# EasyEDA schematic SAIIoT2020_AccelKart.json

## Sheets
1 Kart: TITLE: Accelerometer Kart; REV: 1.0; Date: 2020-12-13; Sheet: 1/1; Company: SAIIoT2020 - ISCTE-IUL
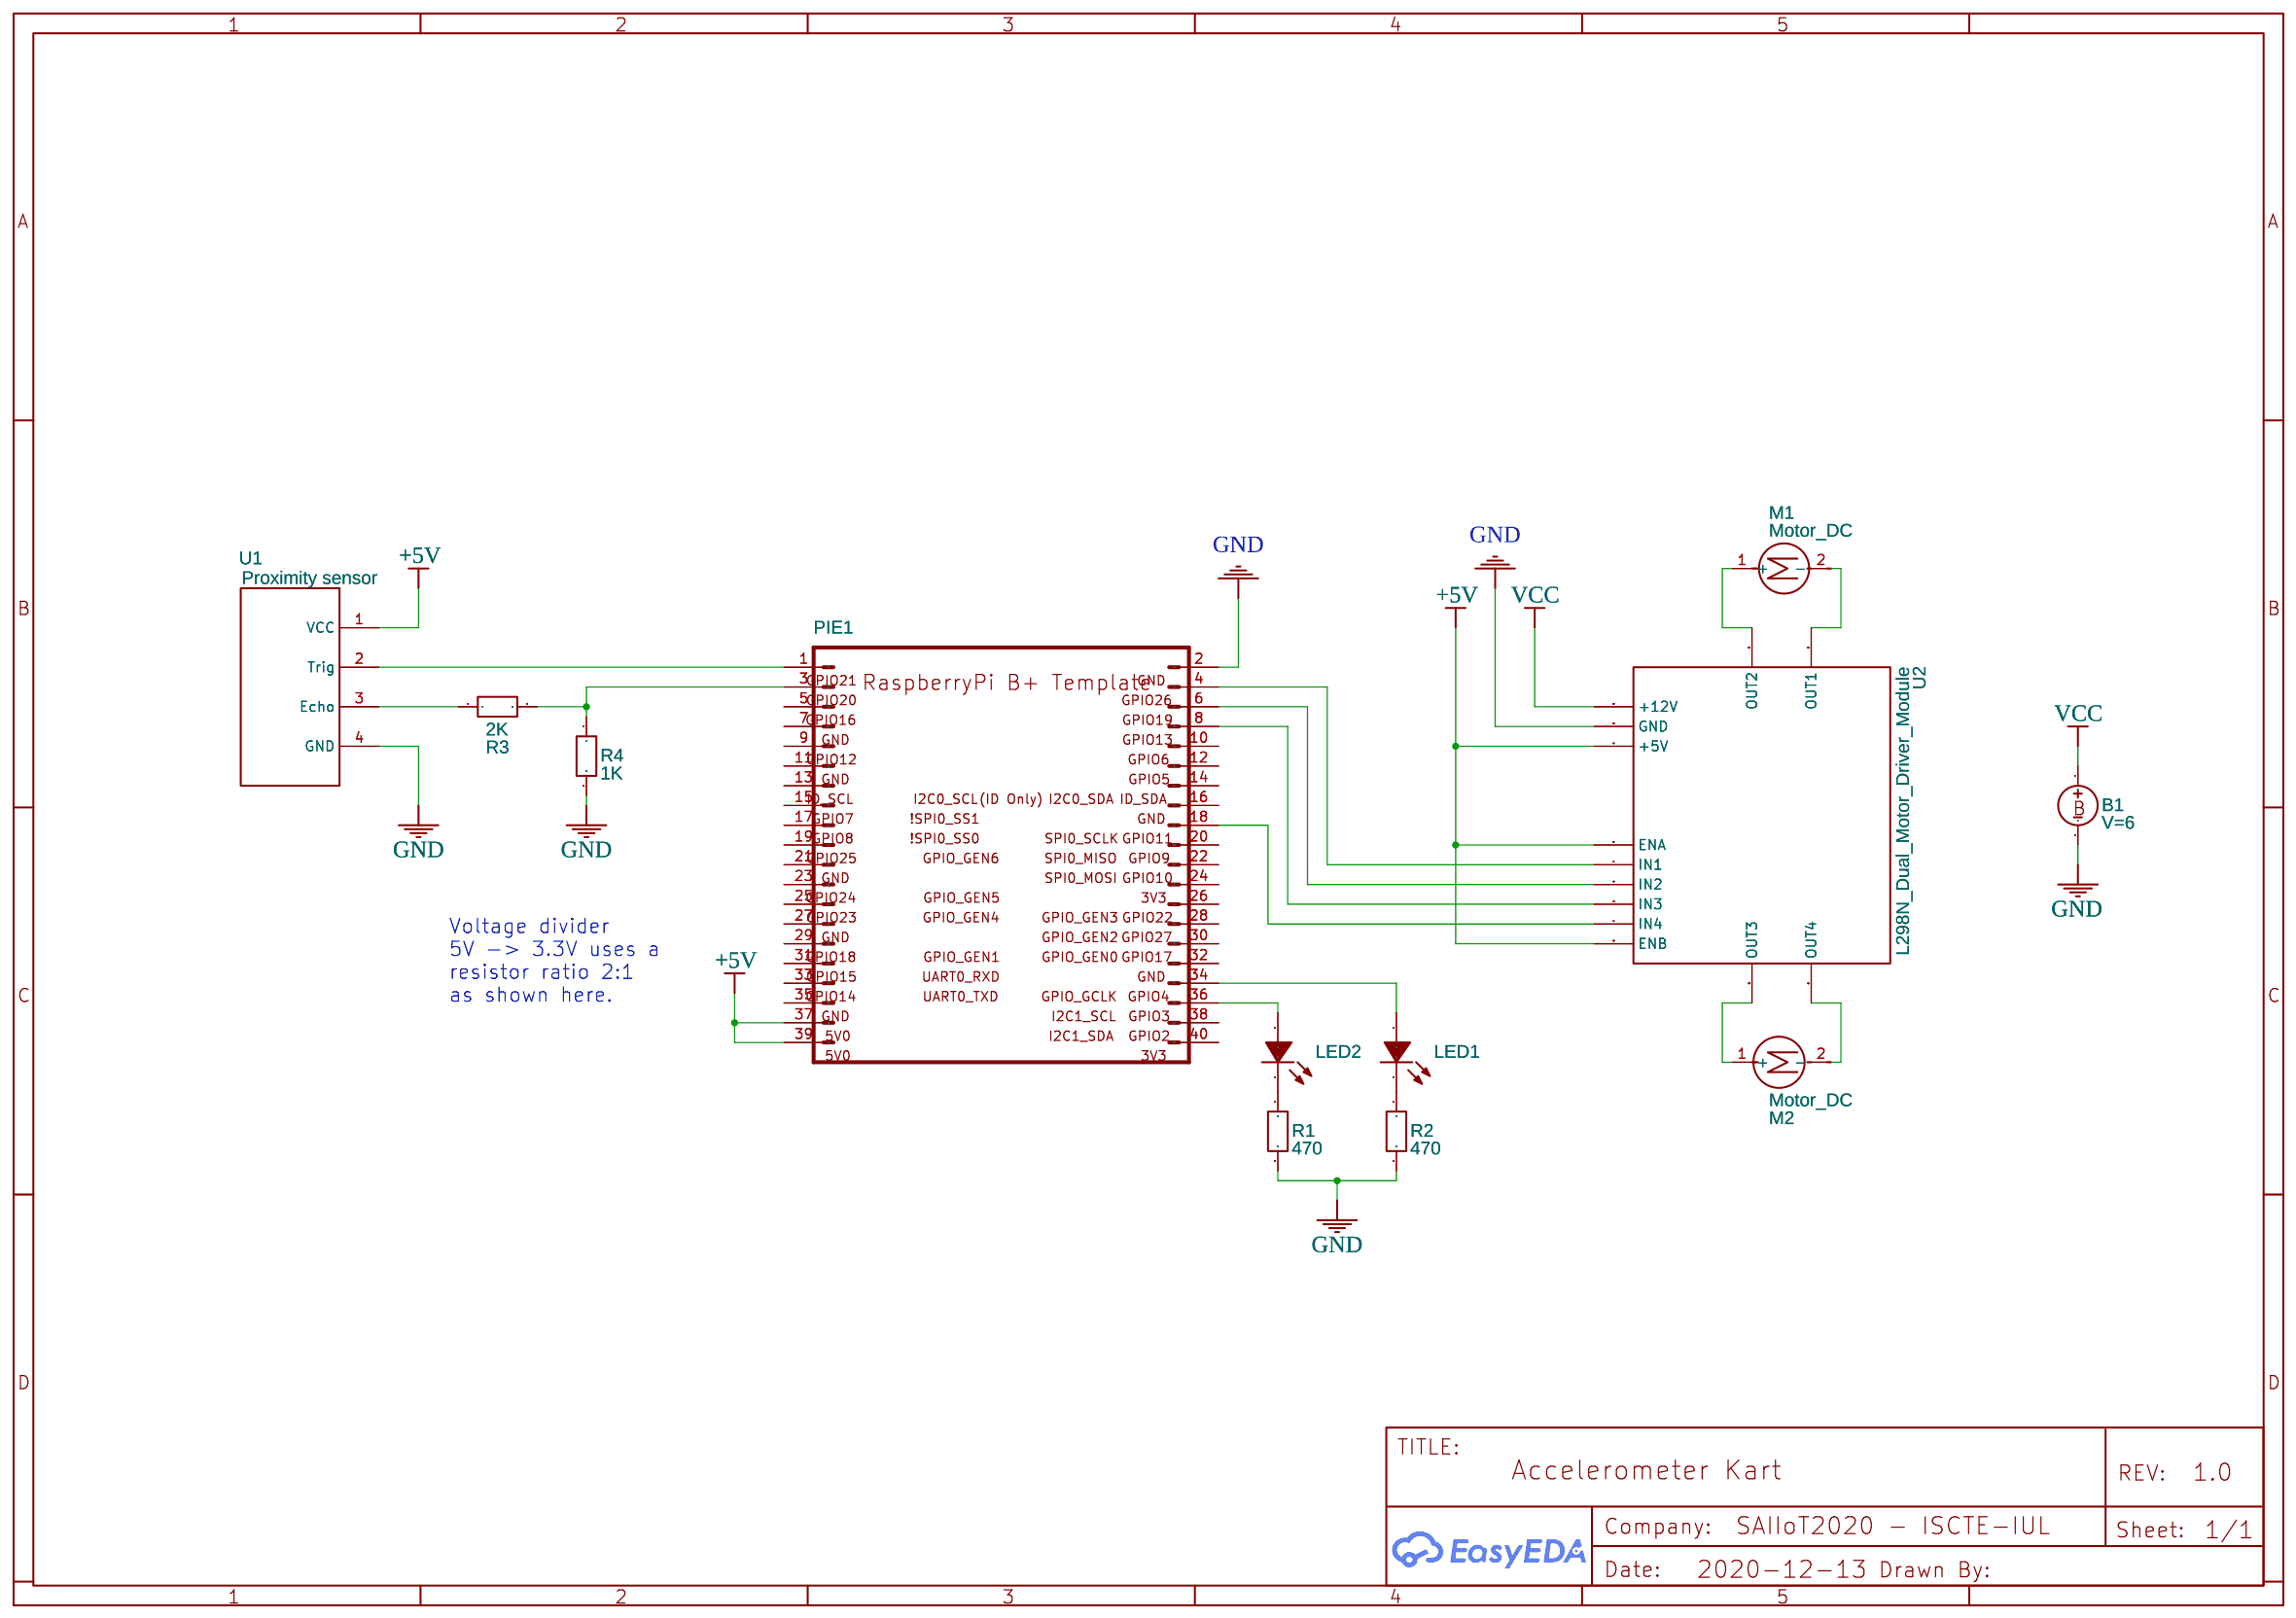
[diagram p0: Kart]
2 Remote 1: TITLE: Accelerometer Kart Remote 1; Date: 2021-01-09; Drawn By: miguel.c.rodrigues
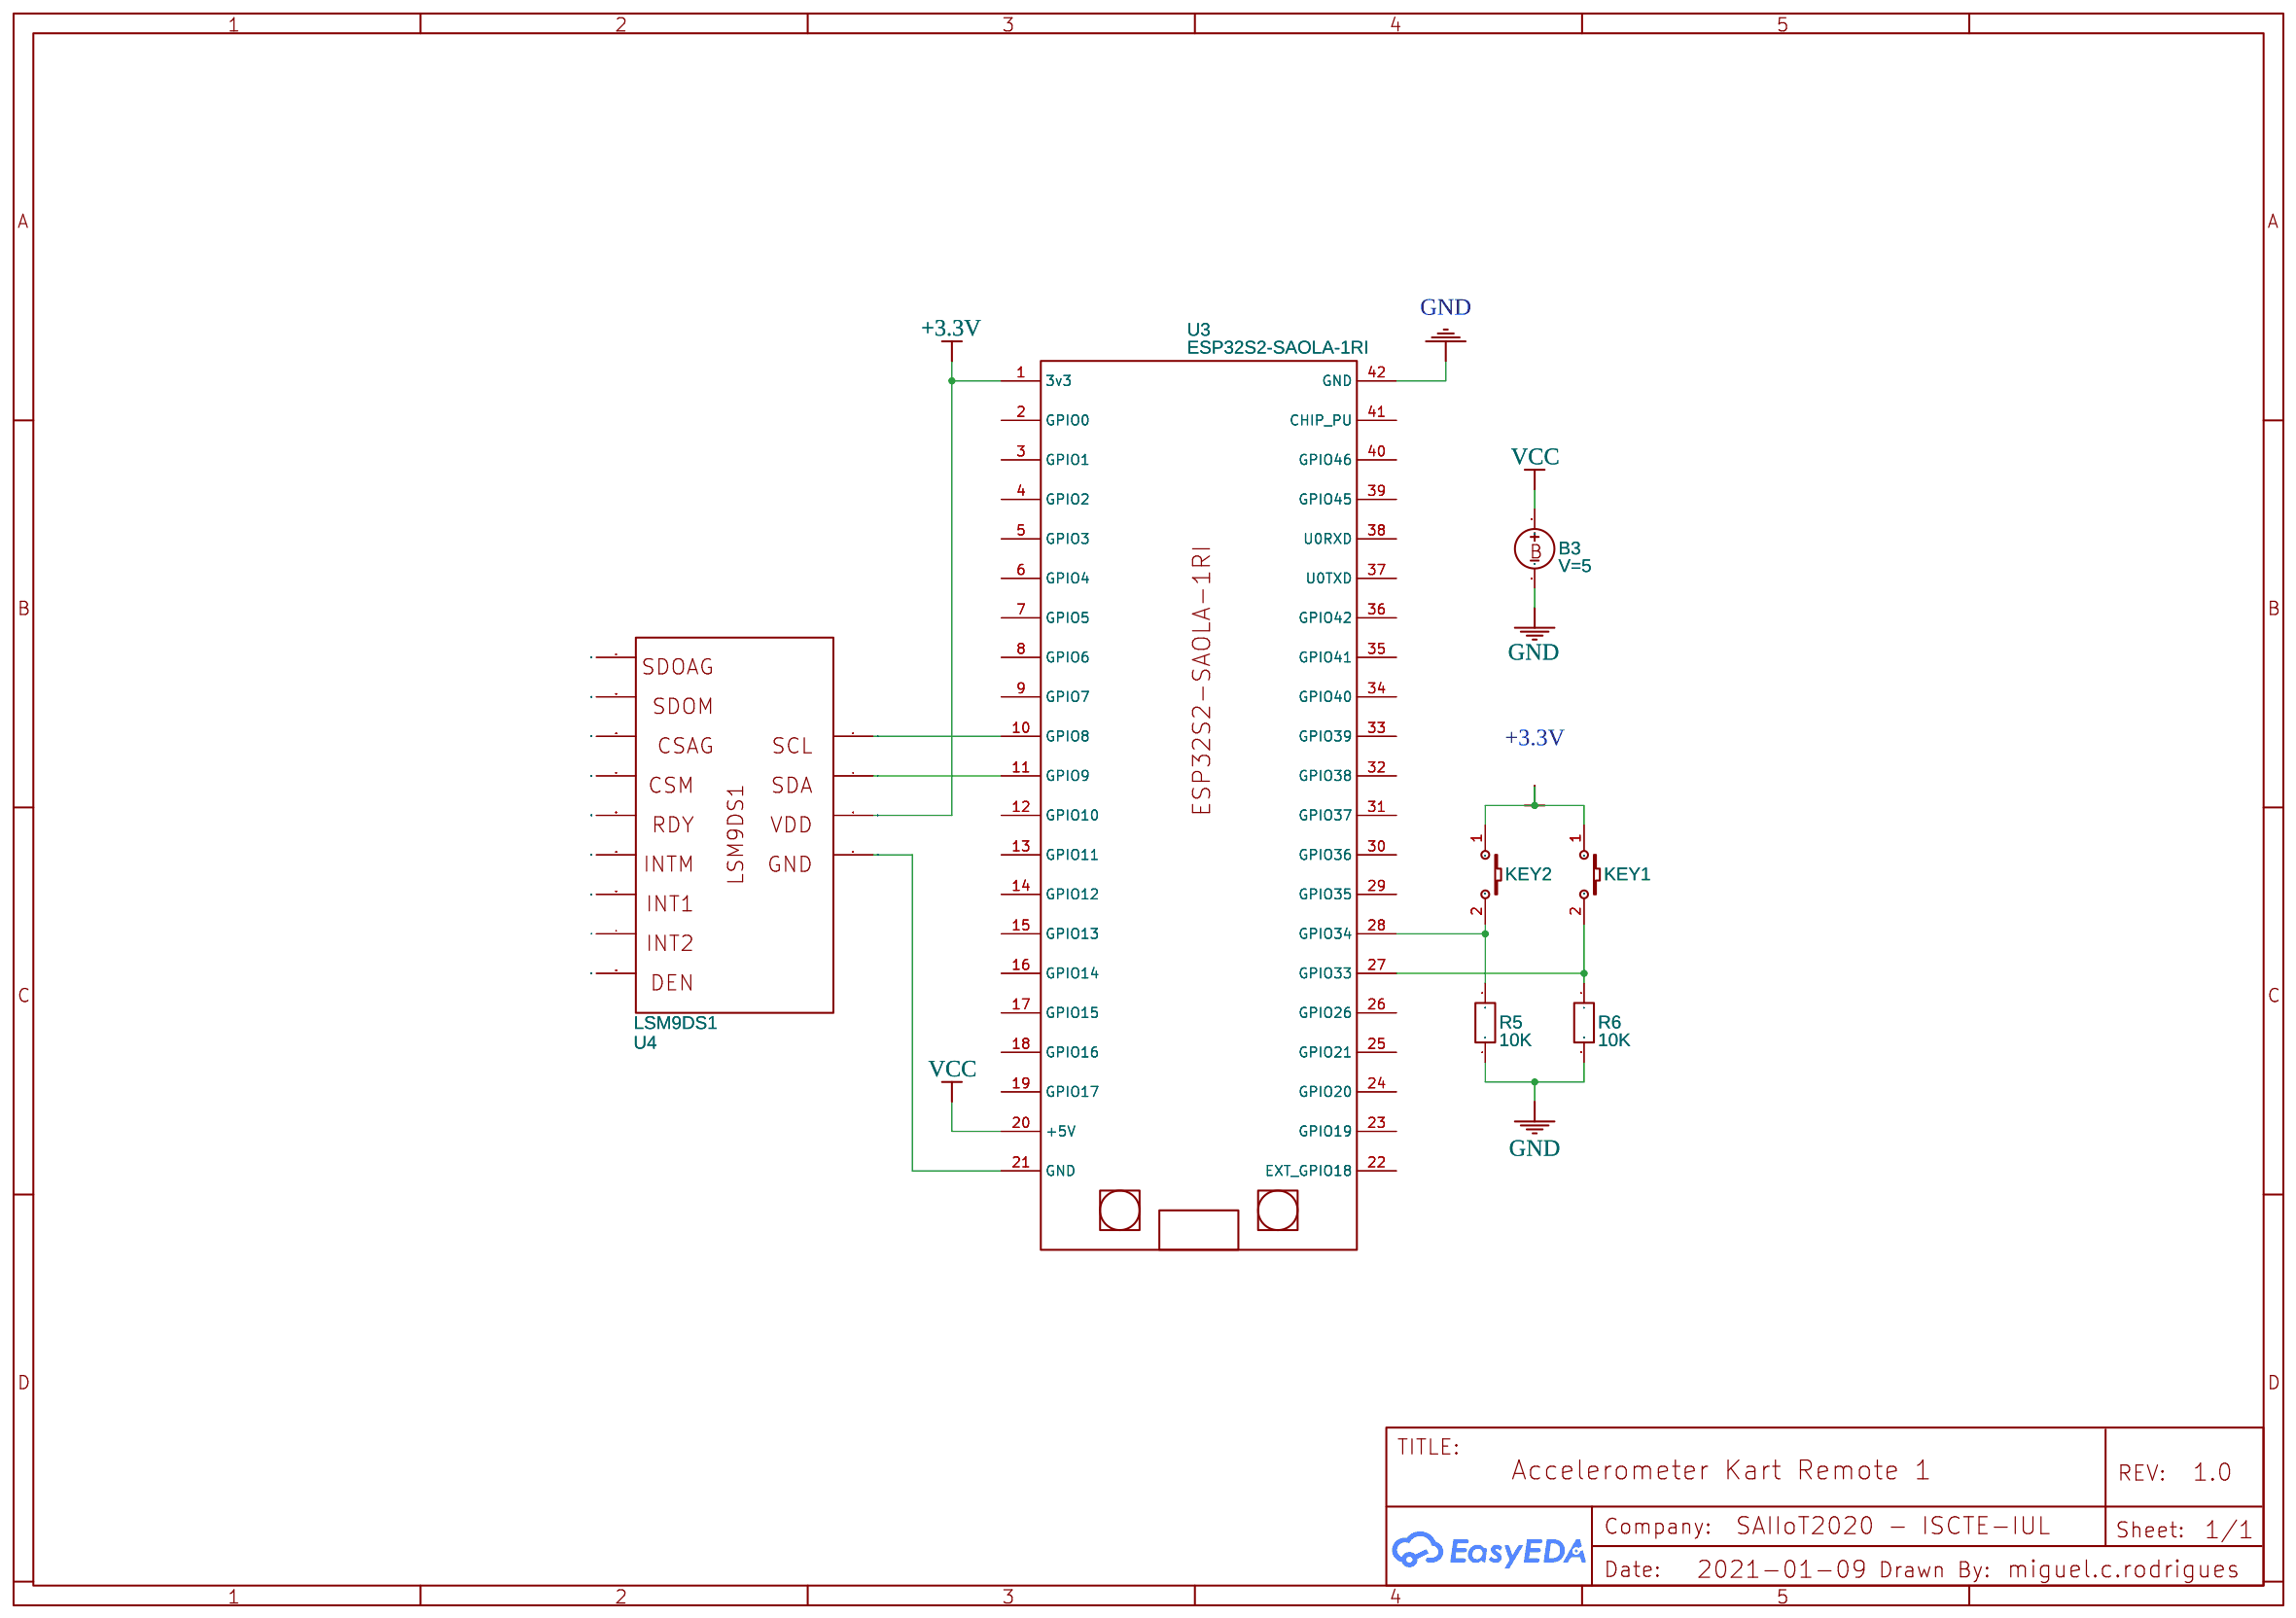
[diagram p1: Remote 1]
3 Remote 2: TITLE: Accelerometer Kart Remote 2; Date: 2021-01-09; Drawn By: miguel.c.rodrigues
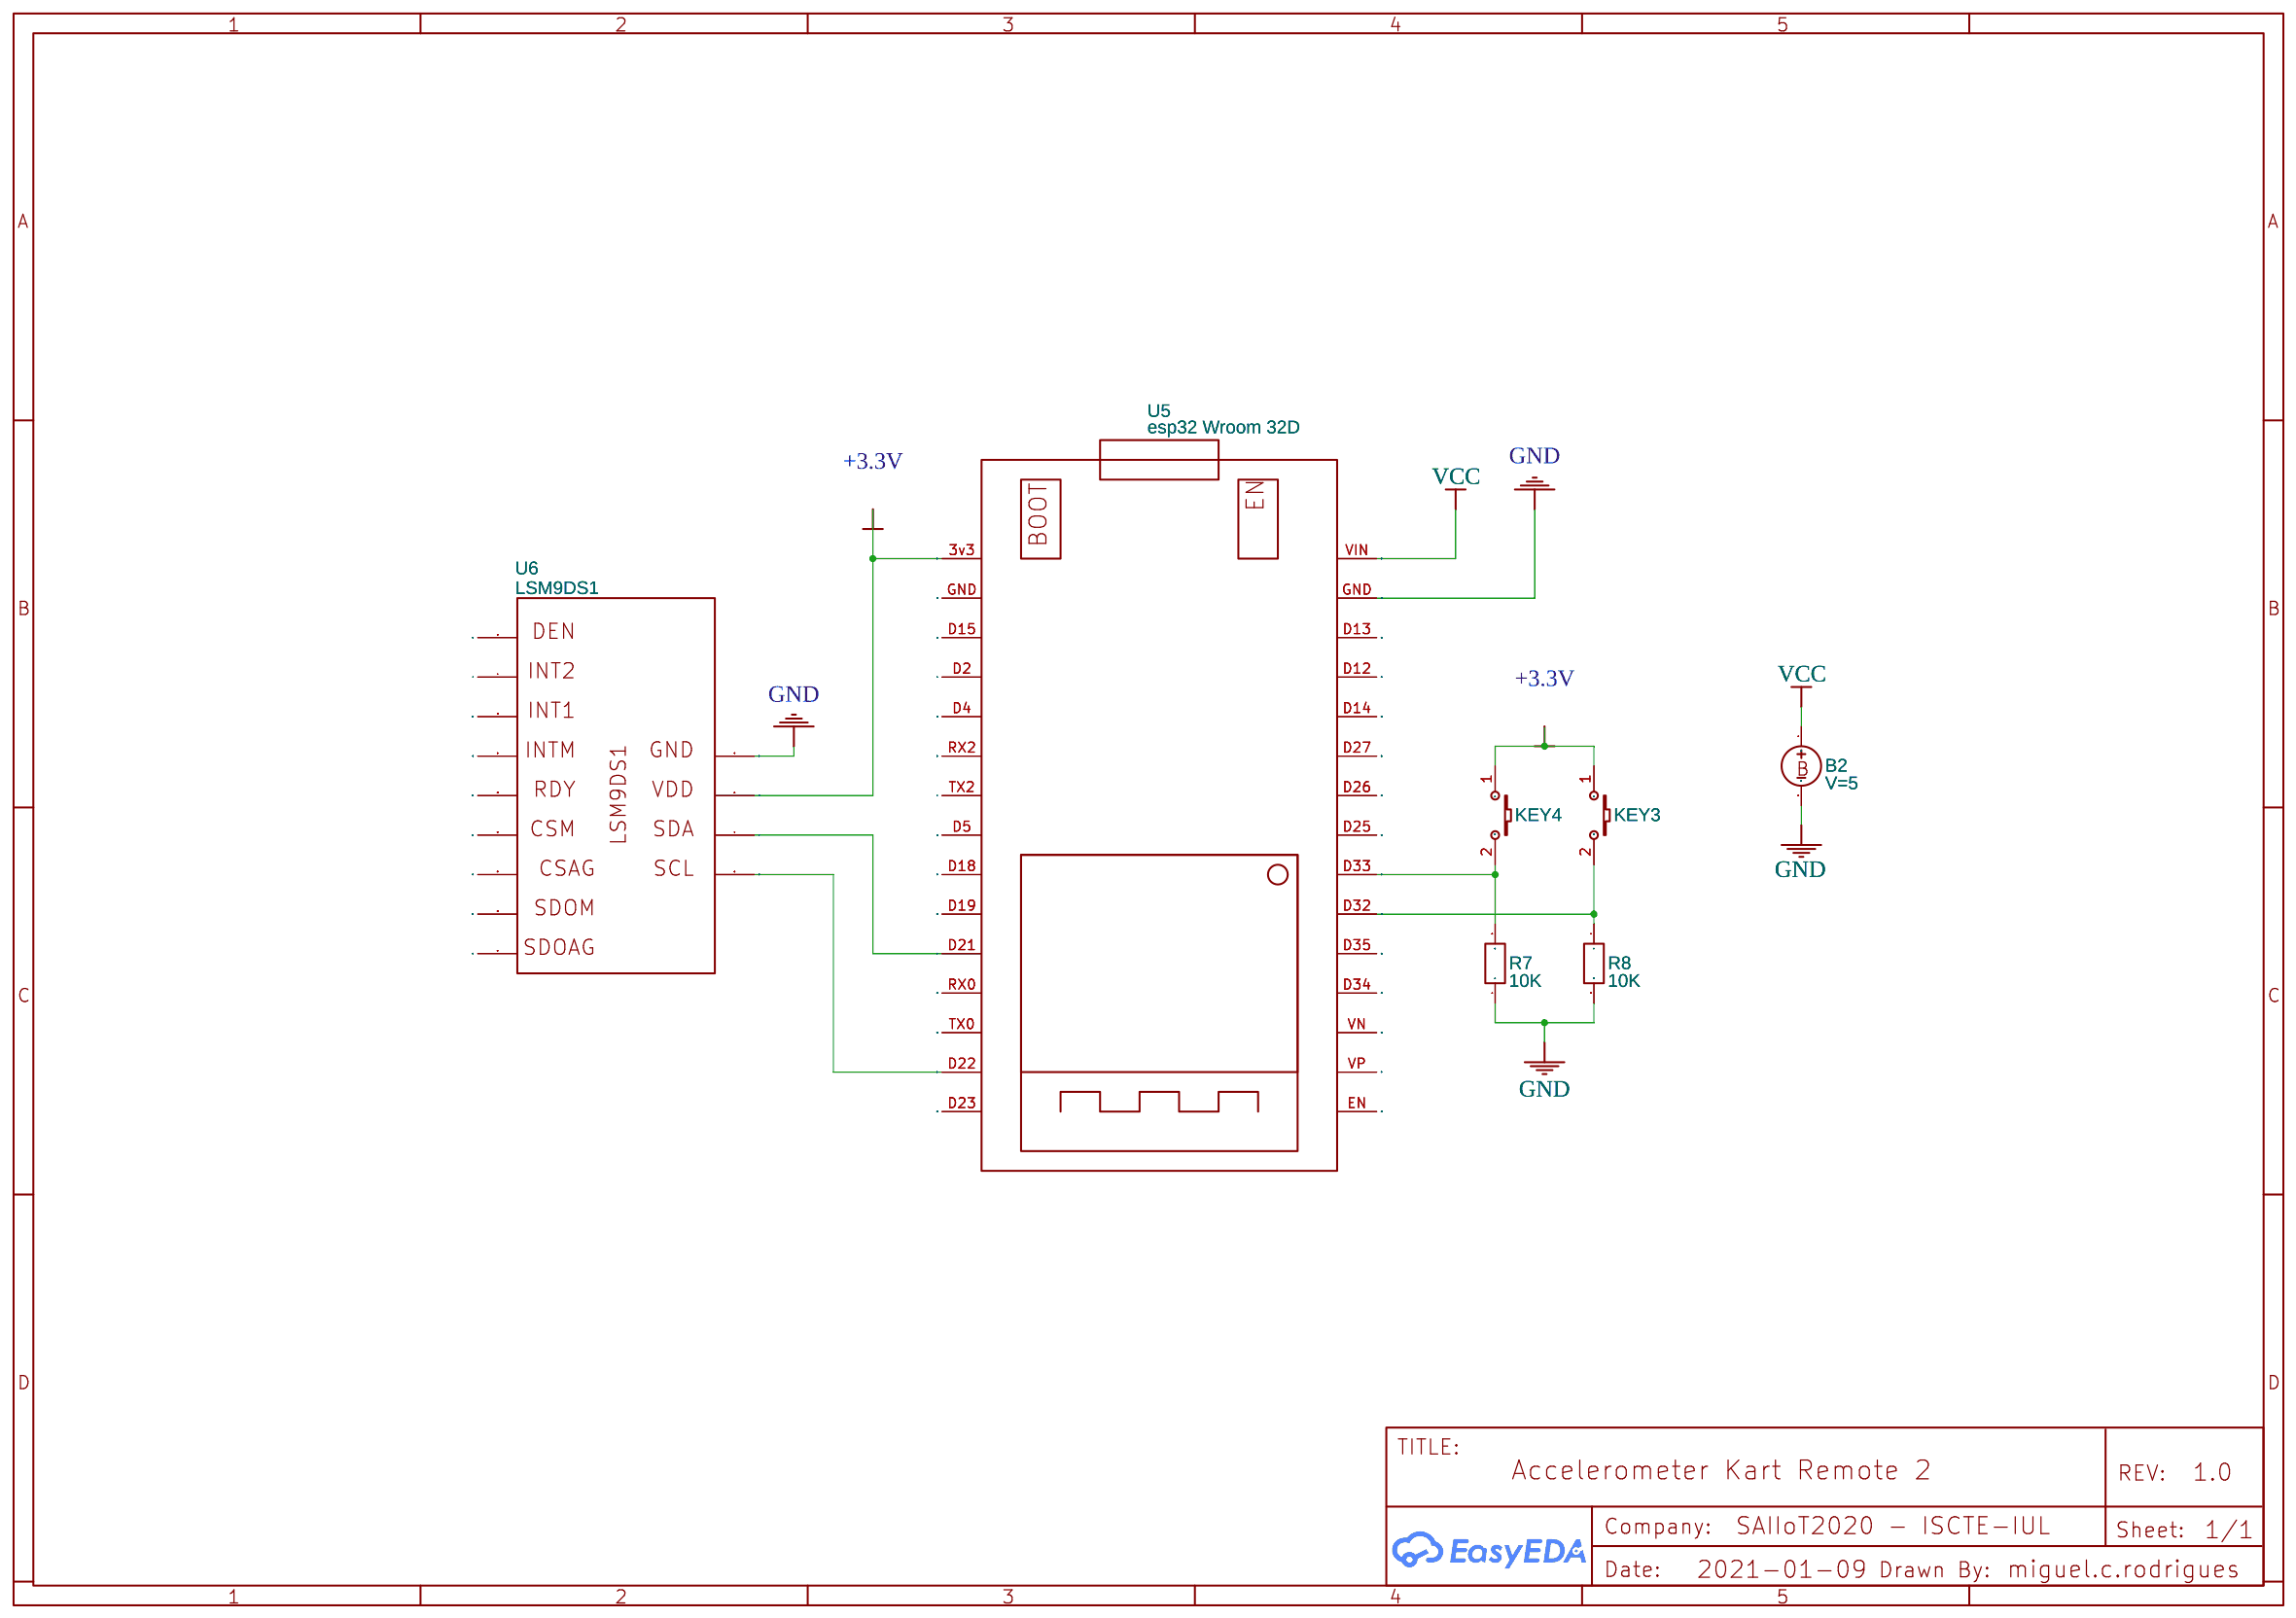
[diagram p2: Remote 2]

## Parts
sheet Kart
B1  V=6  [HDR1X2]
LED1  LED-0603_R  [LED0603_RED]
LED2  LED-0603_R  [LED0603_RED]
M1  Motor_DC  [CONN-TH_2P-P5.08]
M2  Motor_DC  [CONN-TH_2P-P5.08]
PIE1  PA_RASPI_BPLUS_BRD  [PA_RASPI_PLATE_BPLUS]
R1  470  [R0603]
R2  470  [R0603]
R3  2K  [R0603]
R4  1K  [R0603]
U1  Proximity sensor  [HC-SR04]
U2  L298N_Dual_Motor_Driver_Module  [L298N DUAL H-BRIDGE MOTOR DRIVER MODULE FOOTPRINT]
sheet Remote 1
B3  V=5  [HDR1X2]
KEY1  K2-3.6×6.1_SMD  [KEY-SMD_2P-L6.2-W3.6-LS8.0]
KEY2  K2-3.6×6.1_SMD  [KEY-SMD_2P-L6.2-W3.6-LS8.0]
R5  10K  [R0603]
R6  10K  [R0603]
U3  ESP32S2-SAOLA-1RI  [ESP32S2-SAOLA-1RI]
U4  LSM9DS1
sheet Remote 2
B2  V=5  [HDR1X2]
KEY3  K2-3.6×6.1_SMD  [KEY-SMD_2P-L6.2-W3.6-LS8.0]
KEY4  K2-3.6×6.1_SMD  [KEY-SMD_2P-L6.2-W3.6-LS8.0]
R7  10K  [R0603]
R8  10K  [R0603]
U5  esp32 Wroom 32D
U6  LSM9DS1

## Library data of the parts
B1-B3 = BV_Behavioral_Source: Link: http://ltwiki.org/LTspiceHelpXVII/LTspiceHelp/html/B-device.htm; Contributor: EasyEDA; sim: true
LED1 LED2 = LED-0603_R: Manufacturer: EVERLIGHT(台湾亿光); Manufacturer Part: 19-217/R6C-AL1M2VY/3T; Supplier Part: C72044; Supplier: LCSC; Contributor: LCEDA_01
M1 M2 = Motor_DC: Contributor: KiCAD; license: https://www.gnu.org/licenses/lgpl-2.1.html
PIE1 = PA_RASPI_BPLUS_BRD: PatternAgents Raspberry Pi B+ Template; Contributor: PatternAgents
R1-R8 = R_0603_EU: Contributor: LCEDA_Lib
U1 = Proximity sensor: Contributor: manorius
U2 = L298N_Dual_Motor_Driver_Module: catid: 20; Contributor: sauron1024; Mounted: No; sim: true
KEY1-KEY4 = K2-3.6×6.1_SMD: Supplier Part: C118141; Supplier: LCSC; Manufacturer Part: K2-1107ST-A4SW-06; Contributor: LCEDA_Lib; 制造商: 韩国韩荣
U3 = ESP32S2-SAOLA-1RI: Manufacturer Part: ESP32 DEV KIT; Contributor: leoScript; link: https://www.espressif.com/en/products/hardware/esp32-devkitc/overview
U4 U6 = LSM9DS1: catid: 20; Contributor: jeniffer.gigi; Manufacturer: Sparkfun; sim: true
U5 = esp32 Wroom 32D: link: https://www.electronicscomp.com/esp32-development-board-with-wifi-bluetooth-india?gclid=Cj0KCQiA0ZHwBRCRARIsAK0Tr-pRP7vgtXoKrnZSuRSrynfS8Mg1Q5gX7mz6SAZvtrOY0-CI_1SEzdQaAuurEALw_wcB; Contributor: VIJENDER KUMAR

## Nets
+3.3V: KEY1.1 KEY2.1 KEY3.1 KEY4.1 U3.1(3v3) U5.3v3(31) U6.3
+5V: PIE1.37 PIE1.39 U1.1(VCC) U2.+5V U2.ENA U2.ENB
GND: B1.2 B2.2 B3.2 PIE1.2 R1.2 R2.2 R4.2 R5.1 R6.2 R7.1 R8.2 U1.4(GND) U2.GND U3.42(GND) U5.GND(29) U6.2
VCC: B1.1 B2.1 B3.1 U2.+12V U3.20(+5V) U5.VIN(30)
Net-(KEY1-2): KEY1.2 R6.1 U3.27(GPIO33)
Net-(KEY2-2): KEY2.2 R5.2 U3.28(GPIO34)
Net-(KEY3-2): KEY3.2 R8.1 U5.D32(21)
Net-(KEY4-2): KEY4.2 R7.2 U5.D33(22)
Net-(LED1-1): LED1.1 PIE1.34
Net-(LED1-2): LED1.2 R2.1
Net-(LED2-1): LED2.1 PIE1.36
Net-(LED2-2): LED2.2 R1.1
Net-(M1-1): M1.1(+) U2.OUT2
Net-(M1-2): M1.2(-) U2.OUT1
Net-(M2-1): M2.1(+) U2.OUT3
Net-(M2-2): M2.2(-) U2.OUT4
Net-(PIE1-1): PIE1.1 U1.2(Trig)
Net-(PIE1-3): PIE1.3 R3.2 R4.1
Net-(PIE1-4): PIE1.4 U2.IN1
Net-(PIE1-6): PIE1.6 U2.IN2
Net-(PIE1-8): PIE1.8 U2.IN3
Net-(PIE1-18): PIE1.18 U2.IN4
Net-(R3-1): R3.1 U1.3(Echo)
Net-(U3-10): U3.10(GPIO8) U4.5
Net-(U3-11): U3.11(GPIO9) U4.4
Net-(U5-D21): U5.D21(11) U6.4
Net-(U5-D22): U5.D22(14) U6.5

Not connected (* = marked no-connect by the designer): PIE1 5 7 9 10 11 12 13 14 15 16 17 19 20 21 22 23 24 25 26 27 28 29 30 31 32 33 35 38 40; U3 2(GPIO0) 3(GPIO1) 4(GPIO2) 5(GPIO3) 6(GPIO4) 7(GPIO5) 8(GPIO6) 9(GPIO7) 12(GPIO10) 13(GPIO11) 14(GPIO12) 15(GPIO13) 16(GPIO14) 17(GPIO15) 18(GPIO16) 19(GPIO17) 21(GND) 22(EXT_GPIO18) 23(GPIO19) 24(GPIO20) 25(GPIO21) 26(GPIO26) 29(GPIO35) 30(GPIO36) 31(GPIO37) 32(GPIO38) 33(GPIO39) 34(GPIO40) 35(GPIO41) 36(GPIO42) 37(U0TXD) 38(U0RXD) 39(GPIO45) 40(GPIO46) 41(CHIP_PU); U4 2 3 6 7 8 9 10 11 12 13 14; U5 D2(4) D4(5) D5(8) D12(27) D13(28) D14(26) D15(3) D18(9) D19(10) D23(15) D25(23) D26(24) D27(25) D34(19) D35(20) EN(16) RX0(12) RX2(6) TX0(13) TX2(7) VN(18) VP(17); U6 6 7 8 9 10 11 12 13 14

## Notes on the sheets
sheet 1
- Voltage divider
  5V -> 3.3V uses a
  resistor ratio 2:1
  as shown here.
